# Altium schematic sheet Safety_2019_V_3_0_RTDS.SchDoc
size A
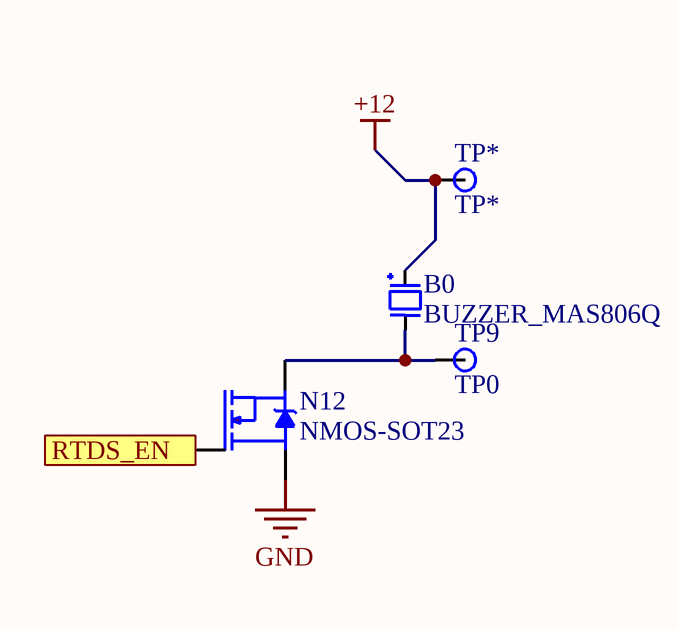
[diagram p0: Safety_2019_V_3_0_RTDS.SchDoc]

## Parts
B0  BUZZER_MAS806Q  [BUZZER_MAS806Q]
N12  NMOS-SOT23  [SOT23]
TP9  TP0  [Testpoint]
TP*  TP*  [Testpoint]

## Ports
RTDS_EN

## Nets
+12: B0.+ TP*.1
GND: N12.2(S)
RTDS_EN: N12.1(G) ; port RTDS_EN
NetB0_-: B0.- N12.3(D) TP9.1

## Library data of the parts
TP9 TP* = Testpoint